# Altium schematic sheet KeypadKeyboard.SchDoc
size Letter
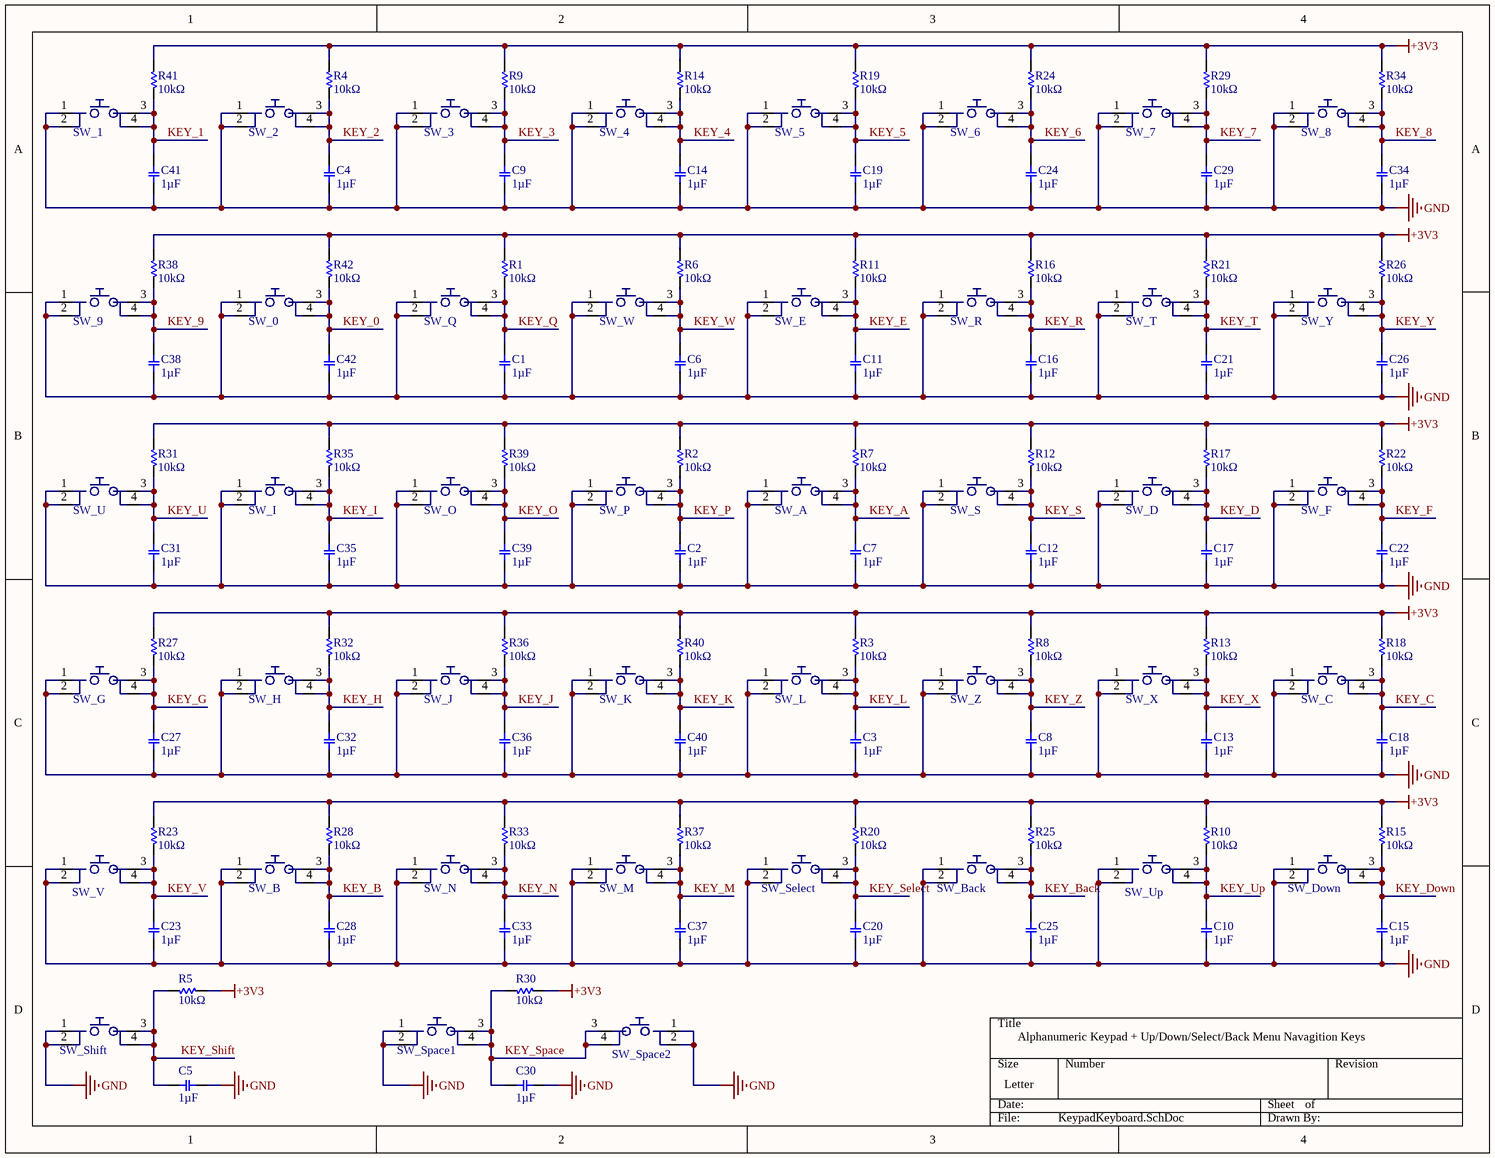
[diagram p0: KeypadKeyboard.SchDoc]

## Parts
C1  1µF  [C0805(2012)_NP_med]
C2  1µF  [C0805(2012)_NP_med]
C3  1µF  [C0805(2012)_NP_med]
C4  1µF  [C0805(2012)_NP_med]
C5  1µF  [C0805(2012)_NP_med]
C6  1µF  [C0805(2012)_NP_med]
C7  1µF  [C0805(2012)_NP_med]
C8  1µF  [C0805(2012)_NP_med]
C9  1µF  [C0805(2012)_NP_med]
C10  1µF  [C0805(2012)_NP_med]
C11  1µF  [C0805(2012)_NP_med]
C12  1µF  [C0805(2012)_NP_med]
C13  1µF  [C0805(2012)_NP_med]
C14  1µF  [C0805(2012)_NP_med]
C15  1µF  [C0805(2012)_NP_med]
C16  1µF  [C0805(2012)_NP_med]
C17  1µF  [C0805(2012)_NP_med]
C18  1µF  [C0805(2012)_NP_med]
C19  1µF  [C0805(2012)_NP_med]
C20  1µF  [C0805(2012)_NP_med]
C21  1µF  [C0805(2012)_NP_med]
C22  1µF  [C0805(2012)_NP_med]
C23  1µF  [C0805(2012)_NP_med]
C24  1µF  [C0805(2012)_NP_med]
C25  1µF  [C0805(2012)_NP_med]
C26  1µF  [C0805(2012)_NP_med]
C27  1µF  [C0805(2012)_NP_med]
C28  1µF  [C0805(2012)_NP_med]
C29  1µF  [C0805(2012)_NP_med]
C30  1µF  [C0805(2012)_NP_med]
C31  1µF  [C0805(2012)_NP_med]
C32  1µF  [C0805(2012)_NP_med]
C33  1µF  [C0805(2012)_NP_med]
C34  1µF  [C0805(2012)_NP_med]
C35  1µF  [C0805(2012)_NP_med]
C36  1µF  [C0805(2012)_NP_med]
C37  1µF  [C0805(2012)_NP_med]
C38  1µF  [C0805(2012)_NP_med]
C39  1µF  [C0805(2012)_NP_med]
C40  1µF  [C0805(2012)_NP_med]
C41  1µF  [C0805(2012)_NP_med]
C42  1µF  [C0805(2012)_NP_med]
R1  10kΩ  [R0805(2012)_med]
R2  10kΩ  [R0805(2012)_med]
R3  10kΩ  [R0805(2012)_med]
R4  10kΩ  [R0805(2012)_med]
R5  10kΩ  [R0805(2012)_med]
R6  10kΩ  [R0805(2012)_med]
R7  10kΩ  [R0805(2012)_med]
R8  10kΩ  [R0805(2012)_med]
R9  10kΩ  [R0805(2012)_med]
R10  10kΩ  [R0805(2012)_med]
R11  10kΩ  [R0805(2012)_med]
R12  10kΩ  [R0805(2012)_med]
R13  10kΩ  [R0805(2012)_med]
R14  10kΩ  [R0805(2012)_med]
R15  10kΩ  [R0805(2012)_med]
R16  10kΩ  [R0805(2012)_med]
R17  10kΩ  [R0805(2012)_med]
R18  10kΩ  [R0805(2012)_med]
R19  10kΩ  [R0805(2012)_med]
R20  10kΩ  [R0805(2012)_med]
R21  10kΩ  [R0805(2012)_med]
R22  10kΩ  [R0805(2012)_med]
R23  10kΩ  [R0805(2012)_med]
R24  10kΩ  [R0805(2012)_med]
R25  10kΩ  [R0805(2012)_med]
R26  10kΩ  [R0805(2012)_med]
R27  10kΩ  [R0805(2012)_med]
R28  10kΩ  [R0805(2012)_med]
R29  10kΩ  [R0805(2012)_med]
R30  10kΩ  [R0805(2012)_med]
R31  10kΩ  [R0805(2012)_med]
R32  10kΩ  [R0805(2012)_med]
R33  10kΩ  [R0805(2012)_med]
R34  10kΩ  [R0805(2012)_med]
R35  10kΩ  [R0805(2012)_med]
R36  10kΩ  [R0805(2012)_med]
R37  10kΩ  [R0805(2012)_med]
R38  10kΩ  [R0805(2012)_med]
R39  10kΩ  [R0805(2012)_med]
R40  10kΩ  [R0805(2012)_med]
R41  10kΩ  [R0805(2012)_med]
R42  10kΩ  [R0805(2012)_med]
SW_0  TE 1825910-6  [TE 1825910-6]  (value not drawn)
SW_1  1825910-6  [TE 1825910-6]  (value not drawn)
SW_2  1825910-6  [TE 1825910-6]  (value not drawn)
SW_3  1825910-6  [TE 1825910-6]  (value not drawn)
SW_4  1825910-6  [TE 1825910-6]  (value not drawn)
SW_5  1825910-6  [TE 1825910-6]  (value not drawn)
SW_6  1825910-6  [TE 1825910-6]  (value not drawn)
SW_7  1825910-6  [TE 1825910-6]  (value not drawn)
SW_8  1825910-6  [TE 1825910-6]  (value not drawn)
SW_9  1825910-6  [TE 1825910-6]  (value not drawn)
SW_A  1825910-6  [TE 1825910-6]  (value not drawn)
SW_B  1825910-6  [TE 1825910-6]  (value not drawn)
SW_Back  1825910-6  [TE 1825910-6]  (value not drawn)
SW_C  1825910-6  [TE 1825910-6]  (value not drawn)
SW_D  1825910-6  [TE 1825910-6]  (value not drawn)
SW_Down  1825910-6  [TE 1825910-6]  (value not drawn)
SW_E  1825910-6  [TE 1825910-6]  (value not drawn)
SW_F  1825910-6  [TE 1825910-6]  (value not drawn)
SW_G  1825910-6  [TE 1825910-6]  (value not drawn)
SW_H  1825910-6  [TE 1825910-6]  (value not drawn)
SW_I  1825910-6  [TE 1825910-6]  (value not drawn)
SW_J  1825910-6  [TE 1825910-6]  (value not drawn)
SW_K  1825910-6  [TE 1825910-6]  (value not drawn)
SW_L  1825910-6  [TE 1825910-6]  (value not drawn)
SW_M  1825910-6  [TE 1825910-6]  (value not drawn)
SW_N  1825910-6  [TE 1825910-6]  (value not drawn)
SW_O  1825910-6  [TE 1825910-6]  (value not drawn)
SW_P  1825910-6  [TE 1825910-6]  (value not drawn)
SW_Q  1825910-6  [TE 1825910-6]  (value not drawn)
SW_R  1825910-6  [TE 1825910-6]  (value not drawn)
SW_S  1825910-6  [TE 1825910-6]  (value not drawn)
SW_Select  1825910-6  [TE 1825910-6]  (value not drawn)
SW_Shift  1825910-6  [TE 1825910-6]  (value not drawn)
SW_Space1  1825910-6  [TE 1825910-6]  (value not drawn)
SW_Space2  1825910-6  [TE 1825910-6]  (value not drawn)
SW_T  1825910-6  [TE 1825910-6]  (value not drawn)
SW_U  1825910-6  [TE 1825910-6]  (value not drawn)
SW_Up  1825910-6  [TE 1825910-6]  (value not drawn)
SW_V  1825910-6  [TE 1825910-6]  (value not drawn)
SW_W  1825910-6  [TE 1825910-6]  (value not drawn)
SW_X  1825910-6  [TE 1825910-6]  (value not drawn)
SW_Y  1825910-6  [TE 1825910-6]  (value not drawn)
SW_Z  1825910-6  [TE 1825910-6]  (value not drawn)

## Nets
+3V3: R1.1 R2.1 R3.1 R4.1 R5.2 R6.1 R7.1 R8.1 R9.1 R10.1 R11.1 R12.1 R13.1 R14.1 R15.1 R16.1 R17.1 R18.1 R19.1 R20.1 R21.1 R22.1 R23.1 R24.1 R25.1 R26.1 R27.1 R28.1 R29.1 R30.1 R31.1 R32.1 R33.1 R34.1 R35.1 R36.1 R37.1 R38.1 R39.1 R40.1 R41.1 R42.1
GND: C1.1 C2.1 C3.1 C4.1 C5.2 C6.1 C7.1 C8.1 C9.1 C10.1 C11.1 C12.1 C13.1 C14.1 C15.1 C16.1 C17.1 C18.1 C19.1 C20.1 C21.1 C22.1 C23.1 C24.1 C25.1 C26.1 C27.1 C28.1 C29.1 C30.2 C31.1 C32.1 C33.1 C34.1 C35.1 C36.1 C37.1 C38.1 C39.1 C40.1 C41.1 C42.1 SW_0.1 SW_0.2 SW_1.1 SW_1.2 SW_2.1 SW_2.2 SW_3.1 SW_3.2 SW_4.1 SW_4.2 SW_5.1 SW_5.2 SW_6.1 SW_6.2 SW_7.1 SW_7.2 SW_8.1 SW_8.2 SW_9.1 SW_9.2 SW_A.1 SW_A.2 SW_B.1 SW_B.2 SW_Back.1 SW_Back.2 SW_C.1 SW_C.2 SW_D.1 SW_D.2 SW_Down.1 SW_Down.2 SW_E.1 SW_E.2 SW_F.1 SW_F.2 SW_G.1 SW_G.2 SW_H.1 SW_H.2 SW_I.1 SW_I.2 SW_J.1 SW_J.2 SW_K.1 SW_K.2 SW_L.1 SW_L.2 SW_M.1 SW_M.2 SW_N.1 SW_N.2 SW_O.1 SW_O.2 SW_P.1 SW_P.2 SW_Q.1 SW_Q.2 SW_R.1 SW_R.2 SW_S.1 SW_S.2 SW_Select.1 SW_Select.2 SW_Shift.1 SW_Shift.2 SW_Space1.1 SW_Space1.2 SW_Space2.1 SW_Space2.2 SW_T.1 SW_T.2 SW_U.1 SW_U.2 SW_Up.1 SW_Up.2 SW_V.1 SW_V.2 SW_W.1 SW_W.2 SW_X.1 SW_X.2 SW_Y.1 SW_Y.2 SW_Z.1 SW_Z.2
KEY_0: C42.2 R42.2 SW_0.3 SW_0.4
KEY_1: C41.2 R41.2 SW_1.3 SW_1.4
KEY_2: C4.2 R4.2 SW_2.3 SW_2.4
KEY_3: C9.2 R9.2 SW_3.3 SW_3.4
KEY_4: C14.2 R14.2 SW_4.3 SW_4.4
KEY_5: C19.2 R19.2 SW_5.3 SW_5.4
KEY_6: C24.2 R24.2 SW_6.3 SW_6.4
KEY_7: C29.2 R29.2 SW_7.3 SW_7.4
KEY_8: C34.2 R34.2 SW_8.3 SW_8.4
KEY_9: C38.2 R38.2 SW_9.3 SW_9.4
KEY_A: C7.2 R7.2 SW_A.3 SW_A.4
KEY_B: C28.2 R28.2 SW_B.3 SW_B.4
KEY_Back: C25.2 R25.2 SW_Back.3 SW_Back.4
KEY_C: C18.2 R18.2 SW_C.3 SW_C.4
KEY_D: C17.2 R17.2 SW_D.3 SW_D.4
KEY_Down: C15.2 R15.2 SW_Down.3 SW_Down.4
KEY_E: C11.2 R11.2 SW_E.3 SW_E.4
KEY_F: C22.2 R22.2 SW_F.3 SW_F.4
KEY_G: C27.2 R27.2 SW_G.3 SW_G.4
KEY_H: C32.2 R32.2 SW_H.3 SW_H.4
KEY_I: C35.2 R35.2 SW_I.3 SW_I.4
KEY_J: C36.2 R36.2 SW_J.3 SW_J.4
KEY_K: C40.2 R40.2 SW_K.3 SW_K.4
KEY_L: C3.2 R3.2 SW_L.3 SW_L.4
KEY_M: C37.2 R37.2 SW_M.3 SW_M.4
KEY_N: C33.2 R33.2 SW_N.3 SW_N.4
KEY_O: C39.2 R39.2 SW_O.3 SW_O.4
KEY_P: C2.2 R2.2 SW_P.3 SW_P.4
KEY_Q: C1.2 R1.2 SW_Q.3 SW_Q.4
KEY_R: C16.2 R16.2 SW_R.3 SW_R.4
KEY_S: C12.2 R12.2 SW_S.3 SW_S.4
KEY_Select: C20.2 R20.2 SW_Select.3 SW_Select.4
KEY_Shift: C5.1 R5.1 SW_Shift.3 SW_Shift.4
KEY_Space: C30.1 R30.2 SW_Space1.3 SW_Space1.4 SW_Space2.3 SW_Space2.4
KEY_T: C21.2 R21.2 SW_T.3 SW_T.4
KEY_U: C31.2 R31.2 SW_U.3 SW_U.4
KEY_Up: C10.2 R10.2 SW_Up.3 SW_Up.4
KEY_V: C23.2 R23.2 SW_V.3 SW_V.4
KEY_W: C6.2 R6.2 SW_W.3 SW_W.4
KEY_X: C13.2 R13.2 SW_X.3 SW_X.4
KEY_Y: C26.2 R26.2 SW_Y.3 SW_Y.4
KEY_Z: C8.2 R8.2 SW_Z.3 SW_Z.4

## Notes on the sheet
- Alphanumeric Keypad + Up/Down/Select/Back Menu Navagition Keys

## Library data of the parts
C1-C42 = CPN_SMT: SMT Capacitor; Tolerance: X7R; Rating: 16v; Value: 1µF
R1-R42 = RES_SMT: SMT resistor; Tolerance: 1%; Value: 10kΩ
SW_0 = TE 1825910-6: SWITCH TACTILE SPST-NO 0.05A 24V; Manufacturer: TE Connectivity Alcoswitch Switches; Switch Function: Off-Mom; Contact Rating @ Voltage: 0.05A @ 24VDC; Actuator Type: Standard; Actuator Height off PCB, from Pins: 5.00mm; Actuator Orientation: Top Actuated; Outline: 6.00mm x 6.00mm; Illumination: Non-Illuminated; Operating Force: 160gf; Actuator Material: Polybutylene Terephthalate (PBT); Switch Travel: 0.25mm; Mechanical Life: 100,000 Cycles; Supplier 1: Digi-Key; Manufacturer Part Number: 1825910-6; RoHS: RoHS Compliant; Category: Switches; Stock 1: 68158; Pricing 1: 1=0.11, 25=0.1012, 50=0.0912, 100=0.0869, 250=0.08028, 500=0.07698, 1000=0.06268, 2000=0.05609, 5000=0.05278 (USD); Packaging: Bulk; Circuit: SPST-NO; Mounting Type: Through Hole; Termination Style: PC Pin; Illumination Voltage (Nominal): -; Illumination Type, Color: -; Ingress Protection: -; Features: -; Operating Temperature: -35°C ~ 85°C; ComponentLink1URL: http://www.te.com/commerce/DocumentDelivery/DDEController?Action=srchrtrv&DocNm=1825910&DocType=Customer+Drawing&DocLang=English; ComponentLink1Description: http://www.te.com/commerce/DocumentDelivery/DDEController?Action=srchrtrv&DocNm=1825910&DocType=Customer+Drawing&DocLang=English
SW_1-SW_9 SW_A SW_B SW_Back SW_C SW_D SW_Down SW_E SW_F SW_G SW_H SW_I SW_J SW_K SW_L SW_M SW_N SW_O SW_P SW_Q SW_R SW_S SW_Select SW_Shift SW_Space1 SW_Space2 SW_T SW_U SW_Up SW_V SW_W SW_X SW_Y SW_Z = 1825910-6: SWITCH TACTILE SPST-NO 0.05A 24V; Manufacturer: TE Connectivity Alcoswitch Switches; Switch Function: Off-Mom; Contact Rating @ Voltage: 0.05A @ 24VDC; Actuator Type: Standard; Actuator Height off PCB, from Pins: 5.00mm; Actuator Orientation: Top Actuated; Outline: 6.00mm x 6.00mm; Illumination: Non-Illuminated; Operating Force: 160gf; Actuator Material: Polybutylene Terephthalate (PBT); Switch Travel: 0.25mm; Mechanical Life: 100,000 Cycles; Supplier 1: Digi-Key; Manufacturer Part Number: 1825910-6; RoHS: RoHS Compliant; Category: Switches; Stock 1: 68158; Pricing 1: 1=0.11, 25=0.1012, 50=0.0912, 100=0.0869, 250=0.08028, 500=0.07698, 1000=0.06268, 2000=0.05609, 5000=0.05278 (USD); Packaging: Bulk; Circuit: SPST-NO; Mounting Type: Through Hole; Termination Style: PC Pin; Illumination Voltage (Nominal): -; Illumination Type, Color: -; Ingress Protection: -; Features: -; Operating Temperature: -35°C ~ 85°C; ComponentLink1URL: http://www.te.com/commerce/DocumentDelivery/DDEController?Action=srchrtrv&DocNm=1825910&DocType=Customer+Drawing&DocLang=English; ComponentLink1Description: http://www.te.com/commerce/DocumentDelivery/DDEController?Action=srchrtrv&DocNm=1825910&DocType=Customer+Drawing&DocLang=English